# EAGLE design GB-WP-D1 (EAGLE 9.6.2)
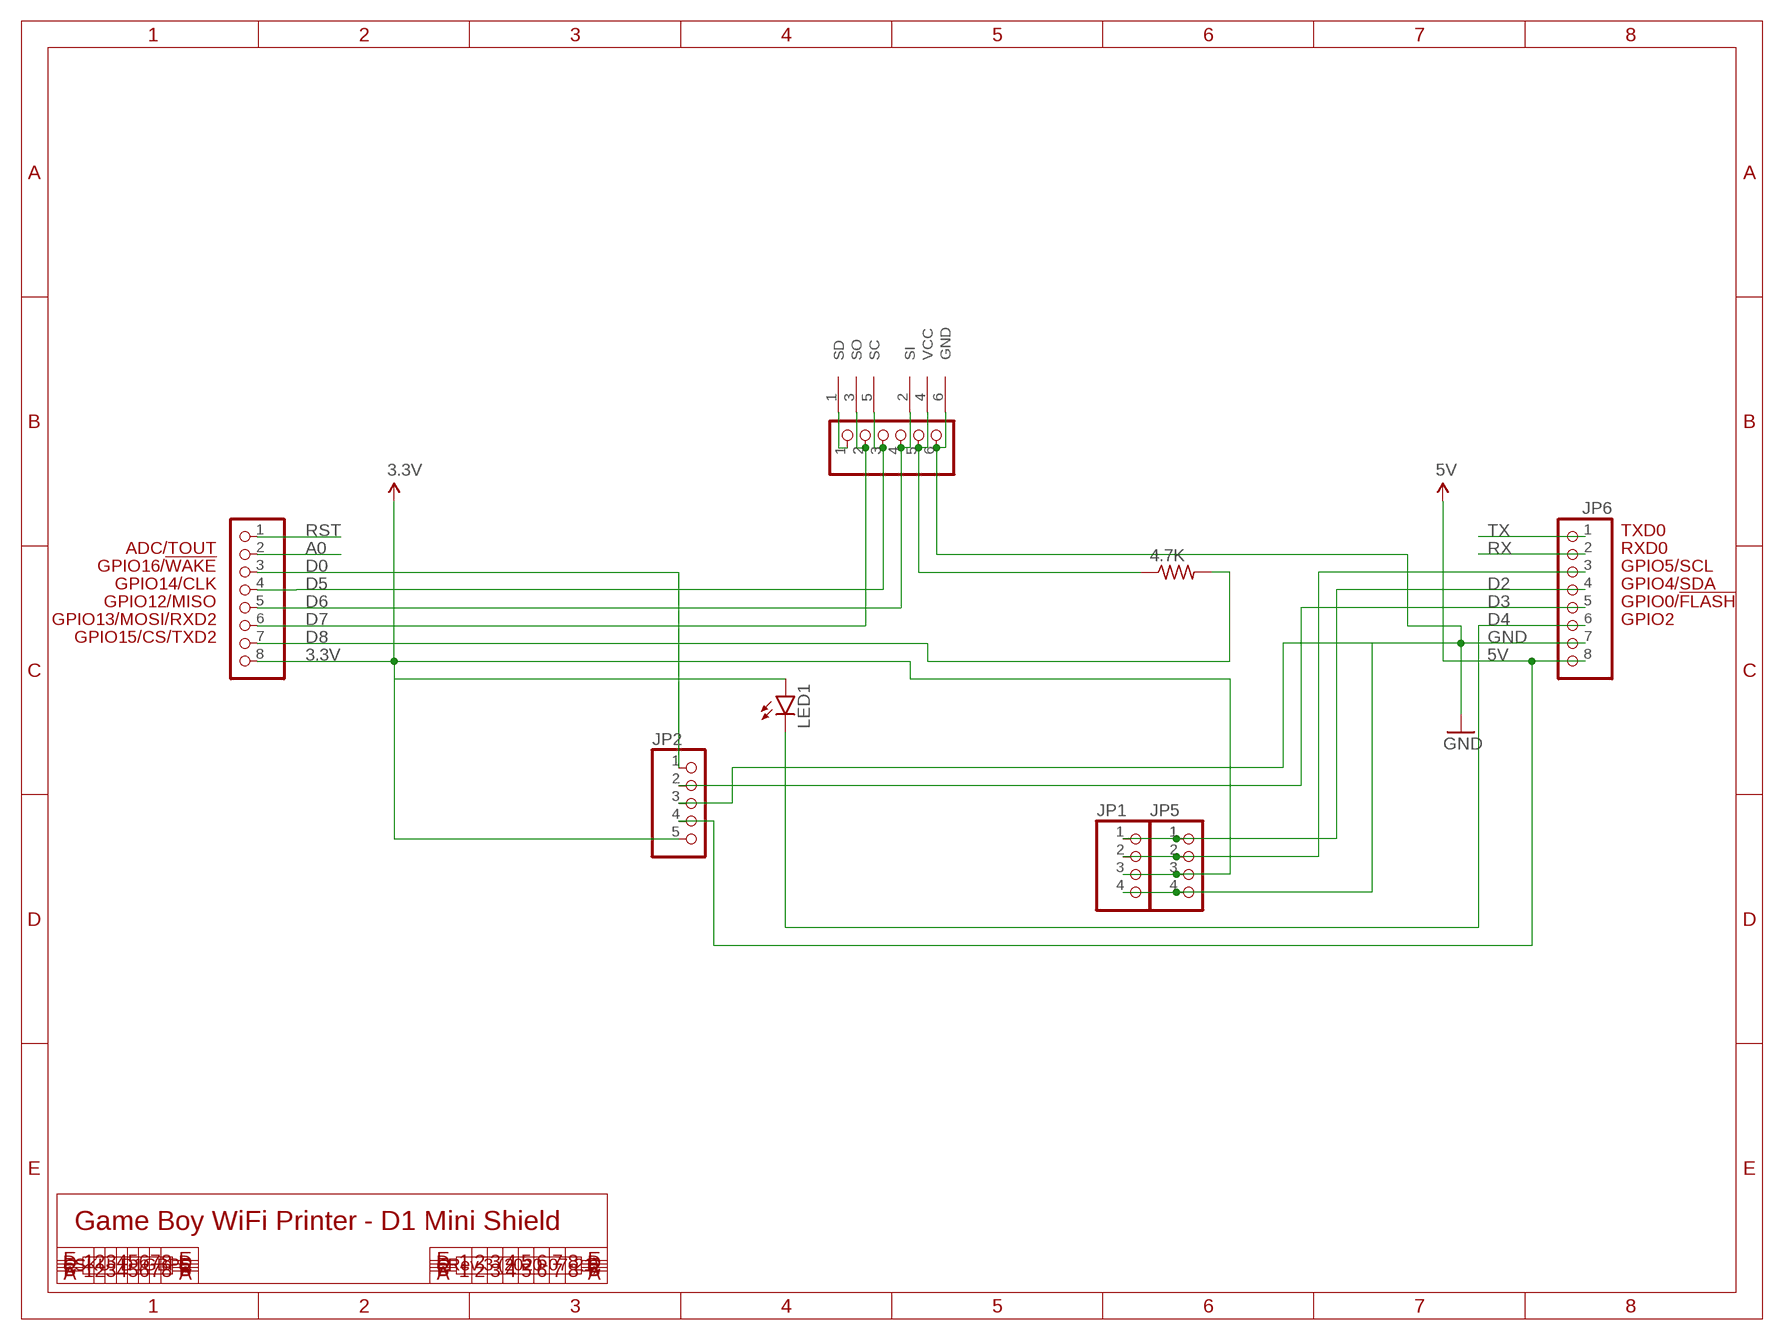
[diagram p0: schematic, sheet 1]

## Parts
4.7K  R-US_0207/10  [0207/10]
JP1  PINHD-1X4/OCT  [1X04/OCT]
JP2  PINHD-1X5/OCT  [1X05/OCT]
JP3  PINHD-1X8/OCT  [1X08/OCT]
JP4  PINHD-1X6/OCT  [1X06/OCT]
JP5  PINHD-1X4/OCT  [1X04/OCT]
JP6  PINHD-1X8/OCT  [1X08/OCT]
LED1  LED3MM  [LED3MM]
U$2  GB-LINK-PADS  [GB-LINK-PCB]

## Nets
3.3V: JP1.3 JP2.5 JP3.8 JP5.3 LED1.A
5V: JP2.4 JP6.8
A0: JP3.2
D0: JP2.1 JP3.3
D2: JP1.1 JP5.1 JP6.4
D3: JP2.2 JP6.5
D4: JP6.6 LED1.K(C)
D5: JP3.4 JP4.3 U$2.5(SC)
D6: JP3.5 JP4.4 U$2.2(SI)
D7: JP3.6 JP4.2 U$2.3(SO)
D8: 4.7K.2 JP3.7
GND: JP1.4 JP2.3 JP4.6 JP5.4 JP6.7 U$2.6(GND)
N$1: JP4.1 U$2.1(SD)
N$5: 4.7K.1 JP4.5 U$2.4(VCC)
N$7: JP1.2 JP5.2 JP6.3
RST: JP3.1
RX: JP6.2
TX: JP6.1

## Notes on the sheet
- TXD0
- ADC/TOUT | RXD0
- GPIO16/!WAKE | GPIO5/SCL
- GPIO14/CLK | GPIO4/SDA
- GPIO12/MISO | GPIO0/!FLASH
- GPIO13/MOSI/RXD2 | GPIO2
- GPIO15/CS/TXD2
- Game Boy WiFi Printer - D1 Mini Shield
- SKU: D1GBPS | Rev.3 (2020-07-21)

## Library data of the parts
4.7K = resistor:R-US_: RESISTOR, American symbol
JP1 JP5 = pinhead_v2:PINHD-1X4: PIN HEADER
JP2 = pinhead_v2:PINHD-1X5: PIN HEADER
JP3 JP6 = pinhead_v2:PINHD-1X8: PIN HEADER
JP4 = pinhead_v2:PINHD-1X6: PIN HEADER
LED1 = led:LED: LED OSRAM: - CHIPLED LG R971, LG N971, LY N971, LG Q971, LY Q971, LO R971, LY R971 LH N974, LH R974 LS Q976, LO Q976, LY Q976 LO Q996 - Hyper CHIPLED LW Q18S LB Q993, LB Q99A, LB R99A - SideLED LS A670, LO A670, LY A670, LG A670, LP A670 LB A673, LV A673, LT A673, LW A673 LH A674 LY A675 LS A676, LA A676, LO A676, LY A676, LW A676 LS A679, LY A679, LG A679 - Hyper Micro SIDELED® LS Y876, LA Y876, LO Y876, LY Y876 LT Y87S - SmartLED LW L88C, LW L88S LB L89C, LB L89S, LG L890 LS L89K, LO L89K, LY L89K LS L896, LA L896, LO L896, LY L896 - TOPLED LS T670, LO T670, LY T670, LG T670, LP T670 LSG T670, LSP T670, LSY T670, LOP T670, LYG T670 LG T671, LOG T671, LSG T671 LB T673, LV T673, LT T673, LW T673 LH T674 LS T676, LA T676, LO T676, LY T676, LB T676, LH T676, LSB T676, LW T676 LB T67C, LV T67C, LT T67C, LS T67K, LO T67K, LY T67K, LW E67C LS E67B, LA E67B, LO E67B, LY E67B, LB E67C, LV E67C, LT E67C LW T67C LS T679, LY T679, LG T679 LS T770, LO T770, LY T770, LG T770, LP T770 LB T773, LV T773, LT T773, LW T773 LH T774 LS E675, LA E675, LY E675, LS T675 LS T776, LA T776, LO T776, LY T776, LB T776 LHGB T686 LT T68C, LB T68C - Hyper Mini TOPLED® LB M676 - Mini TOPLED Santana® LG M470 LS M47K, LO M47K, LY M47K Source: http://www.osram.convergy.de LUXEON: - LUMILED® LXK2-PW12-R00, LXK2-PW12-S00, LXK2-PW14-U00, LXK2-PW14-V00 LXK2-PM12-R00, LXK2-PM12-S00, LXK2-PM14-U00 LXK2-PE12-Q00, LXK2-PE12-R00, LXK2-PE12-S00, LXK2-PE14-T00, LXK2-PE14-U00 LXK2-PB12-K00, LXK2-PB12-L00, LXK2-PB12-M00, LXK2-PB14-N00, LXK2-PB14-P00, LXK2-PB14-Q00 LXK2-PR12-L00, LXK2-PR12-M00, LXK2-PR14-Q00, LXK2-PR14-R00 LXK2-PD12-Q00, LXK2-PD12-R00, LXK2-PD12-S00 LXK2-PH12-R00, LXK2-PH12-S00 LXK2-PL12-P00, LXK2-PL12-Q00, LXK2-PL12-R00 Source: www.luxeon.com KINGBRIGHT: KA-3528ASYC Source: www.kingbright.com
U$2 = link-port-pcb:GB-LINK-PADS

## Net classes
0 default: width 0.203 mm, drill 0.356 mm, clearance 0.152 mm
1 power: width 0.203 mm, clearance 0.152 mm

## Board
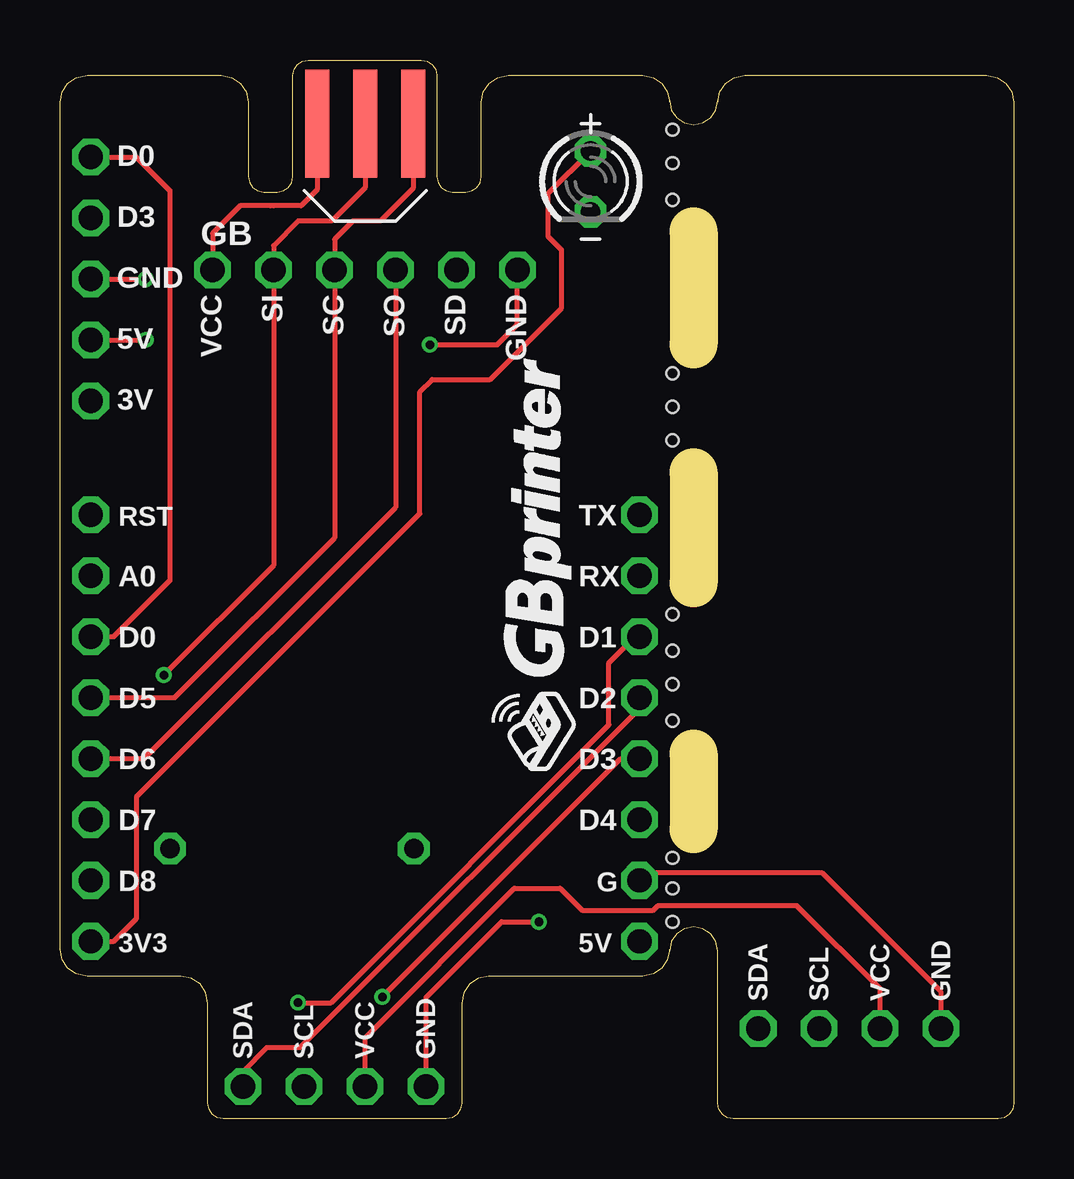
[diagram p1: board, top side]
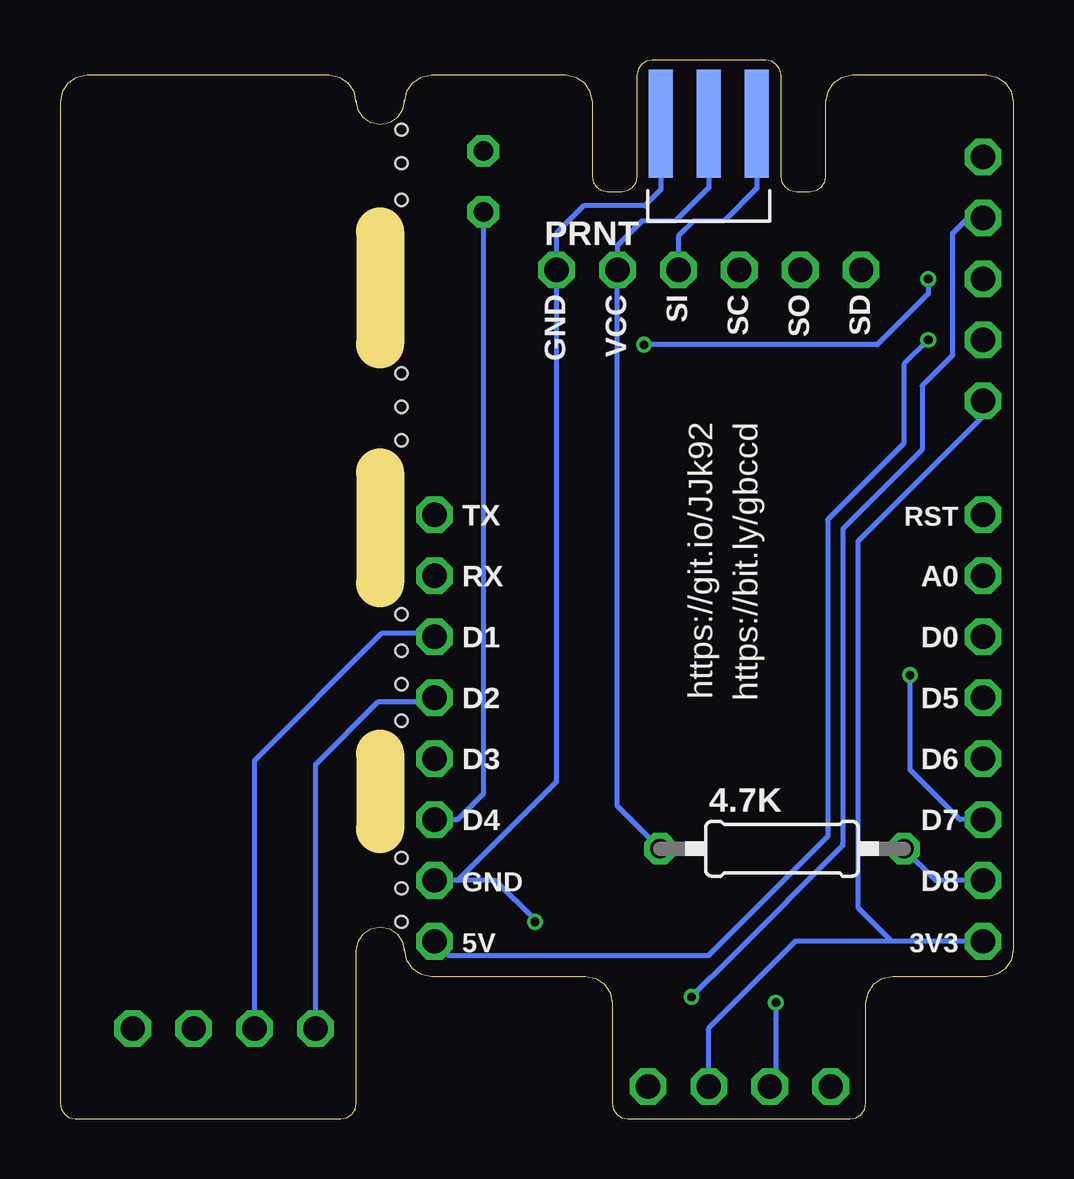
[diagram p2: board, bottom side, seen from below]

Size 39.74 x 44.14 mm. Coordinates in mm from the lower left corner, seen from the top.
Outline: 26.4,15.22 26.4,12.07
Outline: 26.4,26.96 26.4,22.33
Outline: 26.4,36.99 26.4,32.29
Outline: 9.7,43.49 9.75,43.74 9.89,43.95 10.1,44.09 10.35,44.14 15.06,44.14 15.31,44.09 15.52,43.95 15.65,43.74 15.7,43.49 15.7,39.28 15.75,39.03 15.89,38.82 16.1,38.69 16.35,38.64 16.91,38.64 17.16,38.69 17.37,38.82 17.51,39.03 17.56,39.28 17.56,42.37 17.64,42.81 17.89,43.16 18.24,43.41 18.68,43.49 24.28,43.49 24.71,43.41 25.07,43.16 25.31,42.81 25.4,42.37 25.4,42.44 25.48,42.05 25.69,41.73 26.01,41.52 26.4,41.44 26.79,41.52 27.11,41.73 27.32,42.05 27.4,42.44 27.4,42.37 27.49,42.81 27.73,43.16 28.09,43.41 28.53,43.49 38.62,43.49 39.06,43.41 39.41,43.16 39.66,42.81 39.74,42.37 39.74,0.64 39.69,0.39 39.56,0.19 39.35,0.05 39.1,0 28.04,0 27.79,0.05 27.59,0.19 27.45,0.39 27.4,0.64 27.4,7.01 27.32,7.39 27.11,7.71 26.79,7.93 26.4,8.01 26.01,7.93 25.69,7.71 25.48,7.39 25.4,7.01 25.4,7.07 25.31,6.64 25.07,6.28 24.71,6.04 24.28,5.95 17.86,5.95 17.42,5.86 17.07,5.62 16.82,5.26 16.74,4.82 16.74,0.64 16.69,0.39 16.55,0.19 16.34,0.05 16.09,0 6.81,0 6.56,0.05 6.35,0.19 6.21,0.39 6.16,0.64 6.16,4.82 6.08,5.26 5.83,5.62 5.48,5.86 5.04,5.95 1.13,5.95 0.69,6.04 0.33,6.28 0.09,6.64 0,7.07 0,42.37 0.09,42.81 0.33,43.16 0.69,43.41 1.13,43.49 6.73,43.49 7.16,43.41 7.52,43.16 7.76,42.81 7.85,42.37 7.85,39.28 7.9,39.03 8.04,38.82 8.24,38.69 8.49,38.64 9.06,38.64 9.31,38.69 9.51,38.82 9.65,39.03 9.7,39.28 9.7,43.49
Copper layers (1*16): Top 0.035mm / dielectric 1.5mm / Bottom 0.035mm
Design rules "ElectroDragon_2layer_DRU_no_angle_20140221 *": minimum track width 6mil, minimum drill 12mil, track to track 6mil, track to pad 6mil, pad to pad 6mil, via to via 6mil, smd to smd 6mil, copper to edge 8mil, drill to drill 6mil, minimum pad ring 10mil, minimum via ring 6mil, stop-mask expansion 4mil, vias tented up to drill 100mil, thermal gap 0.3mm
Holes 0.5 mm at 25.52,9.61 25.52,10.88 25.52,8.21 25.52,18.12 25.52,21.04 25.52,16.59 25.52,29.67 25.52,31.07 25.52,28.28 25.52,39.83 25.52,41.23 25.52,38.31 25.52,19.51
Milling: 3 lines

### Footprints (pad centres in the part's own frame; a part is rotated, then mirrored left to right if it is on the bottom)
0207/10 = drill 0.813 octagon: 1 -5.08,0; 2 5.08,0
1X04/OCT = drill 1.016 octagon: 1 -3.81,0; 2 -1.27,0; 3 1.27,0; 4 3.81,0
1X05/OCT = drill 1.016 octagon: 1 -5.08,0; 2 -2.54,0; 3 0,0; 4 2.54,0; 5 5.08,0
1X08/OCT = drill 1.016 octagon: 1 -8.89,0; 2 -6.35,0; 3 -3.81,0; 4 -1.27,0; 5 1.27,0; 6 3.81,0; 7 6.35,0; 8 8.89,0
1X06/OCT = drill 1.016 octagon: 1 -6.35,0; 2 -3.81,0; 3 -1.27,0; 4 1.27,0; 5 3.81,0; 6 6.35,0
LED3MM = drill 0.813 octagon: A -1.27,0; K 1.27,0
GB-LINK-PCB = smd 1 x 4.5: 1 -2,0; 3 0,0; 5 2,0 | smd 1 x 4.5 bottom: 2 -2,0; 4 0,0; 6 2,0

### Placement (x,y rotation side)
4.7K  9.66,11.26 0 bottom
JP1  11.44,1.35 0 top
JP2  1.28,35.01 270 top
JP3  1.28,16.29 270 top
JP4  12.71,35.39 0 top
JP5  32.9,3.77 0 top
JP6  24.14,16.29 270 top
LED1  22.11,39.07 270 top
U$2  12.71,41.49 0 top

### Tracks (layer width: path | path; a pad name or v marks a point on that pad's centre or on a via)
3.3V
  Top 0.203: JP3.8 2.25,7.4 3.19,8.34 3.19,13.42 15,25.23 15,30.31 15.5,30.82 17.92,30.82 20.9,33.8 20.9,36.22 20.33,36.79 20.33,38.56 LED1.A | JP5.3 34.17,5.42 30.71,8.89 24.91,8.89 24.72,8.69 21.75,8.69 20.84,9.61 18.93,9.61 12.71,3.39 JP1.3
  Bottom 0.203: JP3.8 5.09,7.4 | 5.09,7.4 9.11,7.4 12.71,3.8 JP1.3 | 5.09,7.4 6.49,8.8 6.49,24.09 1.28,29.29 JP2.5
5V  (via drill 0.36)
  Top 0.203: JP2.4 v3.57,32.47
  Bottom 0.203: JP6.8 23.56,6.81 12.71,6.81 7.76,11.77 7.76,24.98 4.58,28.15 4.58,31.45 v3.57,32.47
D0
  Top 0.203: JP2.1 3.19,40.09 4.58,38.69 4.58,22.44 2.25,20.1 JP3.3
D2
  Top 0.203: JP1.1 7.63,1.99 8.6,2.96 10,2.96 24.14,17.08 JP6.4
  Bottom 0.203: JP5.1 29.09,14.78 26.48,17.39 24.31,17.39 JP6.4
D3  (via drill 0.36)
  Top 0.203: v13.43,5.08 23.37,15.02 JP6.5
  Bottom 0.203: JP2.2 1.92,37.55 2.55,36.91 2.55,31.83 3.82,30.56 3.82,27.9 7.12,24.59 7.12,11.51 7.12,11.39 | v13.43,5.08 11.76,6.75 11.72,6.8 7.12,11.39 | 7.12,11.39
D4
  Bottom 0.203: LED1.K 22.11,13.55 23.18,12.48 JP6.6
D5
  Top 0.203: U$2.5 14.71,38.79 13.35,37.42 12.2,37.42 11.44,36.66 JP4.3 11.44,24.21 4.79,17.56 JP3.4
D6
  Top 0.203: JP4.4 13.98,25.48 3.52,15.02 JP3.5
  Bottom 0.203: U$2.2 10.71,38.79 12.08,37.42 13.35,37.42 13.98,36.79 JP4.4
D7  (via drill 0.36)
  Top 0.203: U$2.3 12.71,38.82 11.31,37.42 9.92,37.42 8.9,36.41 JP4.2 8.9,23.07 v4.33,18.5
  Bottom 0.203: v4.33,18.5 4.33,14.56 2.25,12.48 JP3.6
D8
  Bottom 0.203: JP3.7 3.26,9.94 4.7K.2
GND  (via drill 0.36)
  Top 0.203: JP6.7 24.45,10.24 31.76,10.24 36.71,5.29 JP5.4 | JP2.3 v3.57,35.01 | v15.41,32.27 18.22,32.27 19.06,33.1 JP4.6 | JP1.4 15.25,5.06 18.4,8.21 v19.95,8.21
  Bottom 0.203: U$2.6 14.71,38.72 15.38,38.06 17.92,38.06 19.06,36.91 JP4.6 19.06,14.05 23.18,9.94 JP6.7 21.6,9.94 19.95,8.29 v19.95,8.21 | v3.57,35.01 3.57,34.39 5.69,32.27 v15.41,32.27
N$1
  Top 0.203: U$2.1 10.71,38.72 10.04,38.06 8.9,38.06 8.77,38.06 7.5,38.06 6.36,36.91 JP4.1
N$5
  Bottom 0.203: U$2.4 12.71,38.82 14.11,37.42 15.5,37.42 16.52,36.41 JP4.5 16.54,35.37 16.54,13.06 4.7K.1
N$7  (via drill 0.36)
  Top 0.203: v9.92,4.85 11.29,4.85 22.87,16.42 22.87,19.01 23.96,20.1 JP6.3
  Bottom 0.203: v9.92,4.85 9.92,1.61 JP1.2 | JP5.2 31.63,14.95 26.33,20.25 24.29,20.25 JP6.3

### Text on the board
tPlace: D0 | D3 | GB | GND | VCC | SI | SC | SO | SD | GND | 5V | 3V | RST | TX | A0 | RX | D0 | D1 | D5 | D2 | D6 | D3 | D7 | D4 | D8 | G | 3V3 | 5V | SDA | SCL | VCC | GND | SDA | SCL | VCC | GND
bPlace: PRNT | SD | SO | SC | SI | VCC | GND | RST | TX | https://bit.ly/gbccd | https://git.io/JJk92 | A0 | RX | D0 | D1 | D5 | D2 | D6 | D3 | D7 | D4 | D8 | GND | 3V3 | 5V